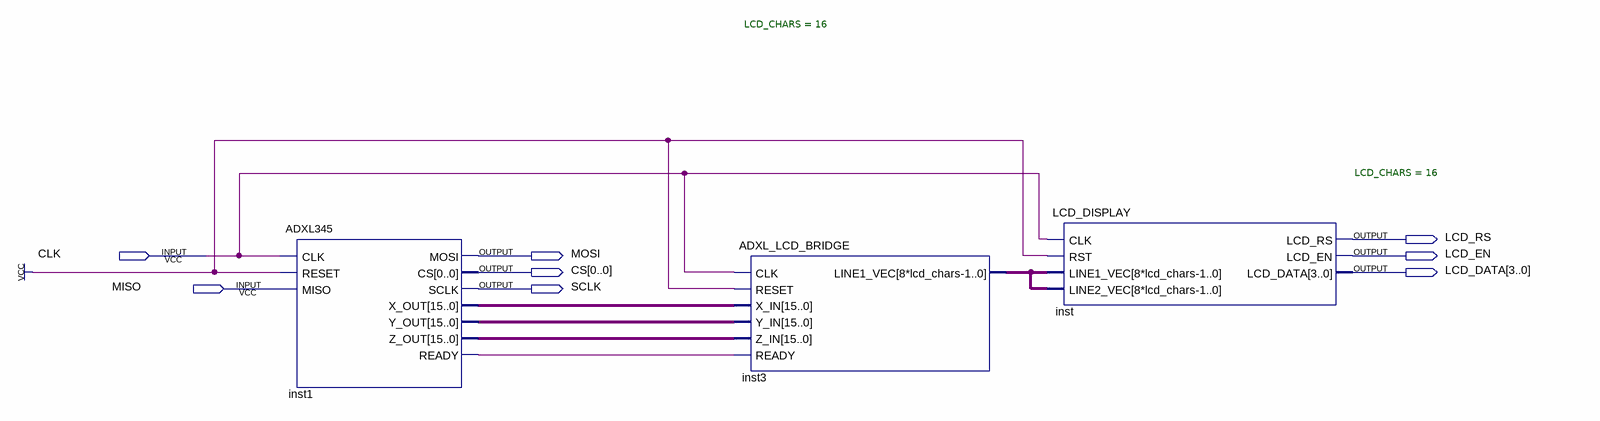
[diagram p0: schematic sheet]
// Quartus schematic ADXL345_and_LCD.bdf as structural Verilog: 3 symbols, 8 pins
module ADXL345_and_LCD (
  input  CLK,
  input  MISO,
  output LCD_RS,
  output MOSI,
  output LCD_EN,
  output [0:0] CS,
  output [3:0] LCD_DATA,
  output SCLK
);

  wire inst1_ready;
  wire [15:0] inst1_x_out, inst1_y_out, inst1_z_out;
  wire [127:0] inst3_line1_vec;

  ADXL345 inst1 (
    .CLK(CLK), .RESET(1'b1), .MISO(MISO), .MOSI(MOSI), .CS(CS[0]), .SCLK(SCLK), .X_OUT(inst1_x_out),
    .Y_OUT(inst1_y_out), .Z_OUT(inst1_z_out), .READY(inst1_ready));
  ADXL_LCD_BRIDGE #(.LCD_CHARS(16)) inst3 (
    .CLK(CLK), .RESET(1'b1), .X_IN(inst1_x_out), .Y_IN(inst1_y_out), .Z_IN(inst1_z_out), .READY(inst1_ready),
    .LINE1_VEC(inst3_line1_vec));
  LCD_DISPLAY #(.LCD_CHARS(16)) inst (
    .CLK(CLK), .RST(1'b1), .LINE1_VEC(inst3_line1_vec), .LINE2_VEC(inst3_line1_vec), .LCD_RS(LCD_RS),
    .LCD_EN(LCD_EN), .LCD_DATA(LCD_DATA));
endmodule
